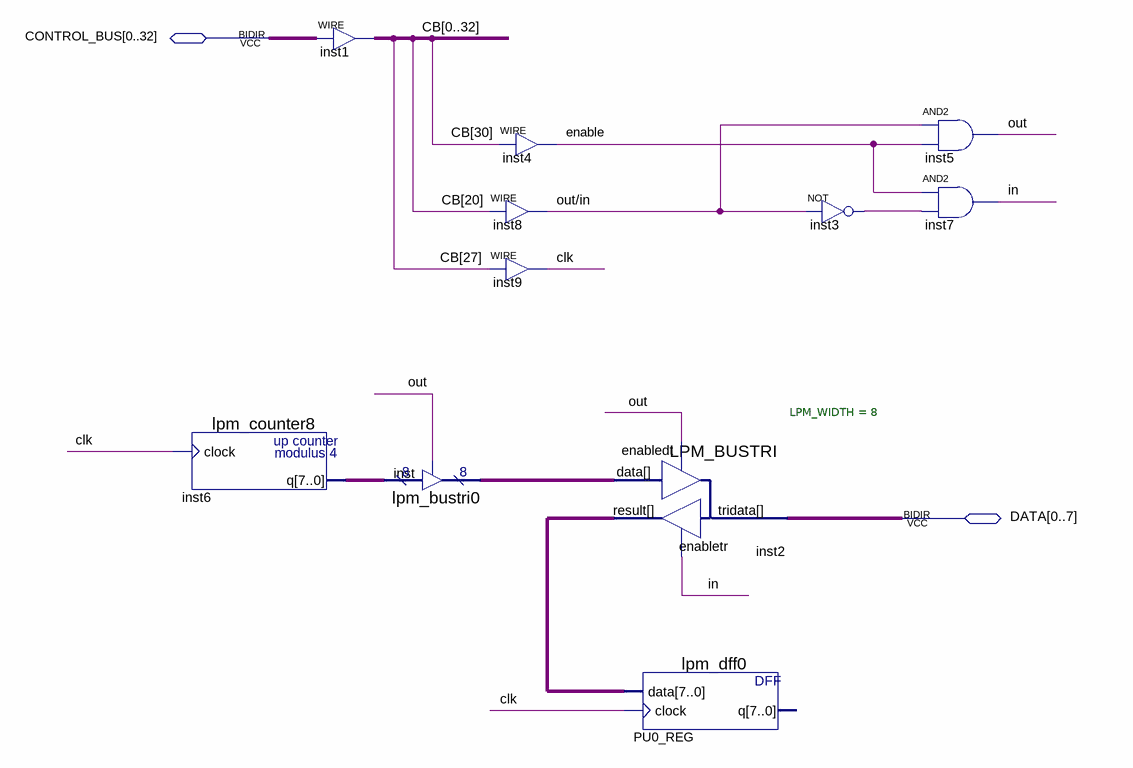
[diagram p0: schematic sheet]
// Quartus schematic PU0.bdf as structural Verilog: 11 symbols, 2 pins
module PU0 (
  inout  [0:32] CONTROL_BUS,
  inout  [0:7] DATA
);

  wire clk, enable, in, inst3_out, out, \out/in ;
  wire [7:0] inst2_result, inst6_q, inst_tridata;
  wire [32:0] CB;

  lpm_counter8 inst6 (.clock(clk), .q(inst6_q));
  assign {CB[0], CB[1], CB[2], CB[3], CB[4], CB[5], CB[6], CB[7], CB[8], CB[9], CB[10], CB[11], CB[12], CB[13], CB[14], CB[15], CB[16], CB[17], CB[18], CB[19], CB[20], CB[21], CB[22], CB[23], CB[24], CB[25], CB[26], CB[27], CB[28], CB[29], CB[30], CB[31], CB[32]} = CONTROL_BUS;  // WIRE inst1
  lpm_bustri0 inst (.enabledt(out), .data(inst6_q), .tridata(inst_tridata));
  assign enable = CB[30];  // WIRE inst4
  assign \out/in  = CB[20];  // WIRE inst8
  assign clk = CB[27];  // WIRE inst9
  LPM_BUSTRI #(.LPM_WIDTH(8)) inst2 (
    .data(inst_tridata), .enabledt(out), .enabletr(in), .result(inst2_result), .tridata(DATA));
  lpm_dff0 PU0_REG (.data(inst2_result), .clock(clk));  // open: q
  not inst3 (inst3_out, \out/in );
  and inst5 (out, \out/in , enable);
  and inst7 (in, enable, inst3_out);
endmodule
